# Altium schematic sheet Top Level.SchDoc
size A
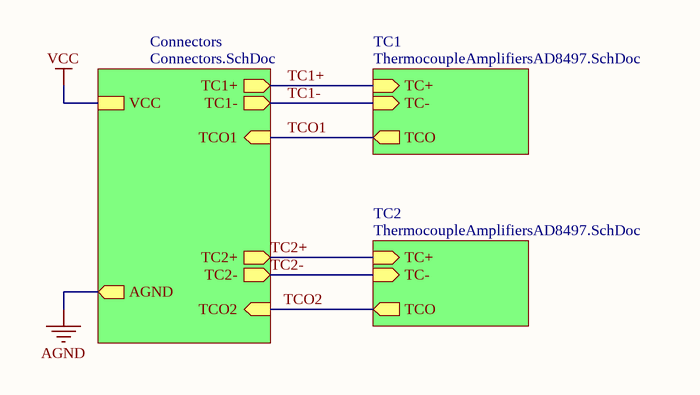
[diagram p0: Top Level.SchDoc]

## Sub-sheets
Connectors = Connectors.SchDoc: TC2- (out), TC1- (out), TC1+ (out), TC2+ (out), TCO1 (in), AGND (out), TCO2 (in), VCC
TC1 = ThermocoupleAmplifiersAD8497.SchDoc: TCO (out), TC+ (in), TC- (in)
TC2 = ThermocoupleAmplifiersAD8497.SchDoc: TCO (out), TC+ (in), TC- (in)

## Nets
AGND: sheet Connectors/AGND
VCC: sheet Connectors/VCC
TC1+: sheet TC1/TC+, sheet Connectors/TC1+
TC1-: sheet TC1/TC-, sheet Connectors/TC1-
TC2+: sheet TC2/TC+, sheet Connectors/TC2+
TC2-: sheet TC2/TC-, sheet Connectors/TC2-
TCO1: sheet TC1/TCO, sheet Connectors/TCO1
TCO2: sheet TC2/TCO, sheet Connectors/TCO2